# EasyEDA Pro project macro.epro

# Schematic WirelessMacropad
Board Name: WirelessMacropad; Create Date: 2025-08-01; Page Name: WirelessMacropad; Project Name: MacroController; Schematic Name: WirelessMacropad; Update Date: 2025-07-31; File: WirelessMacropad; Id: /; Sheet: /
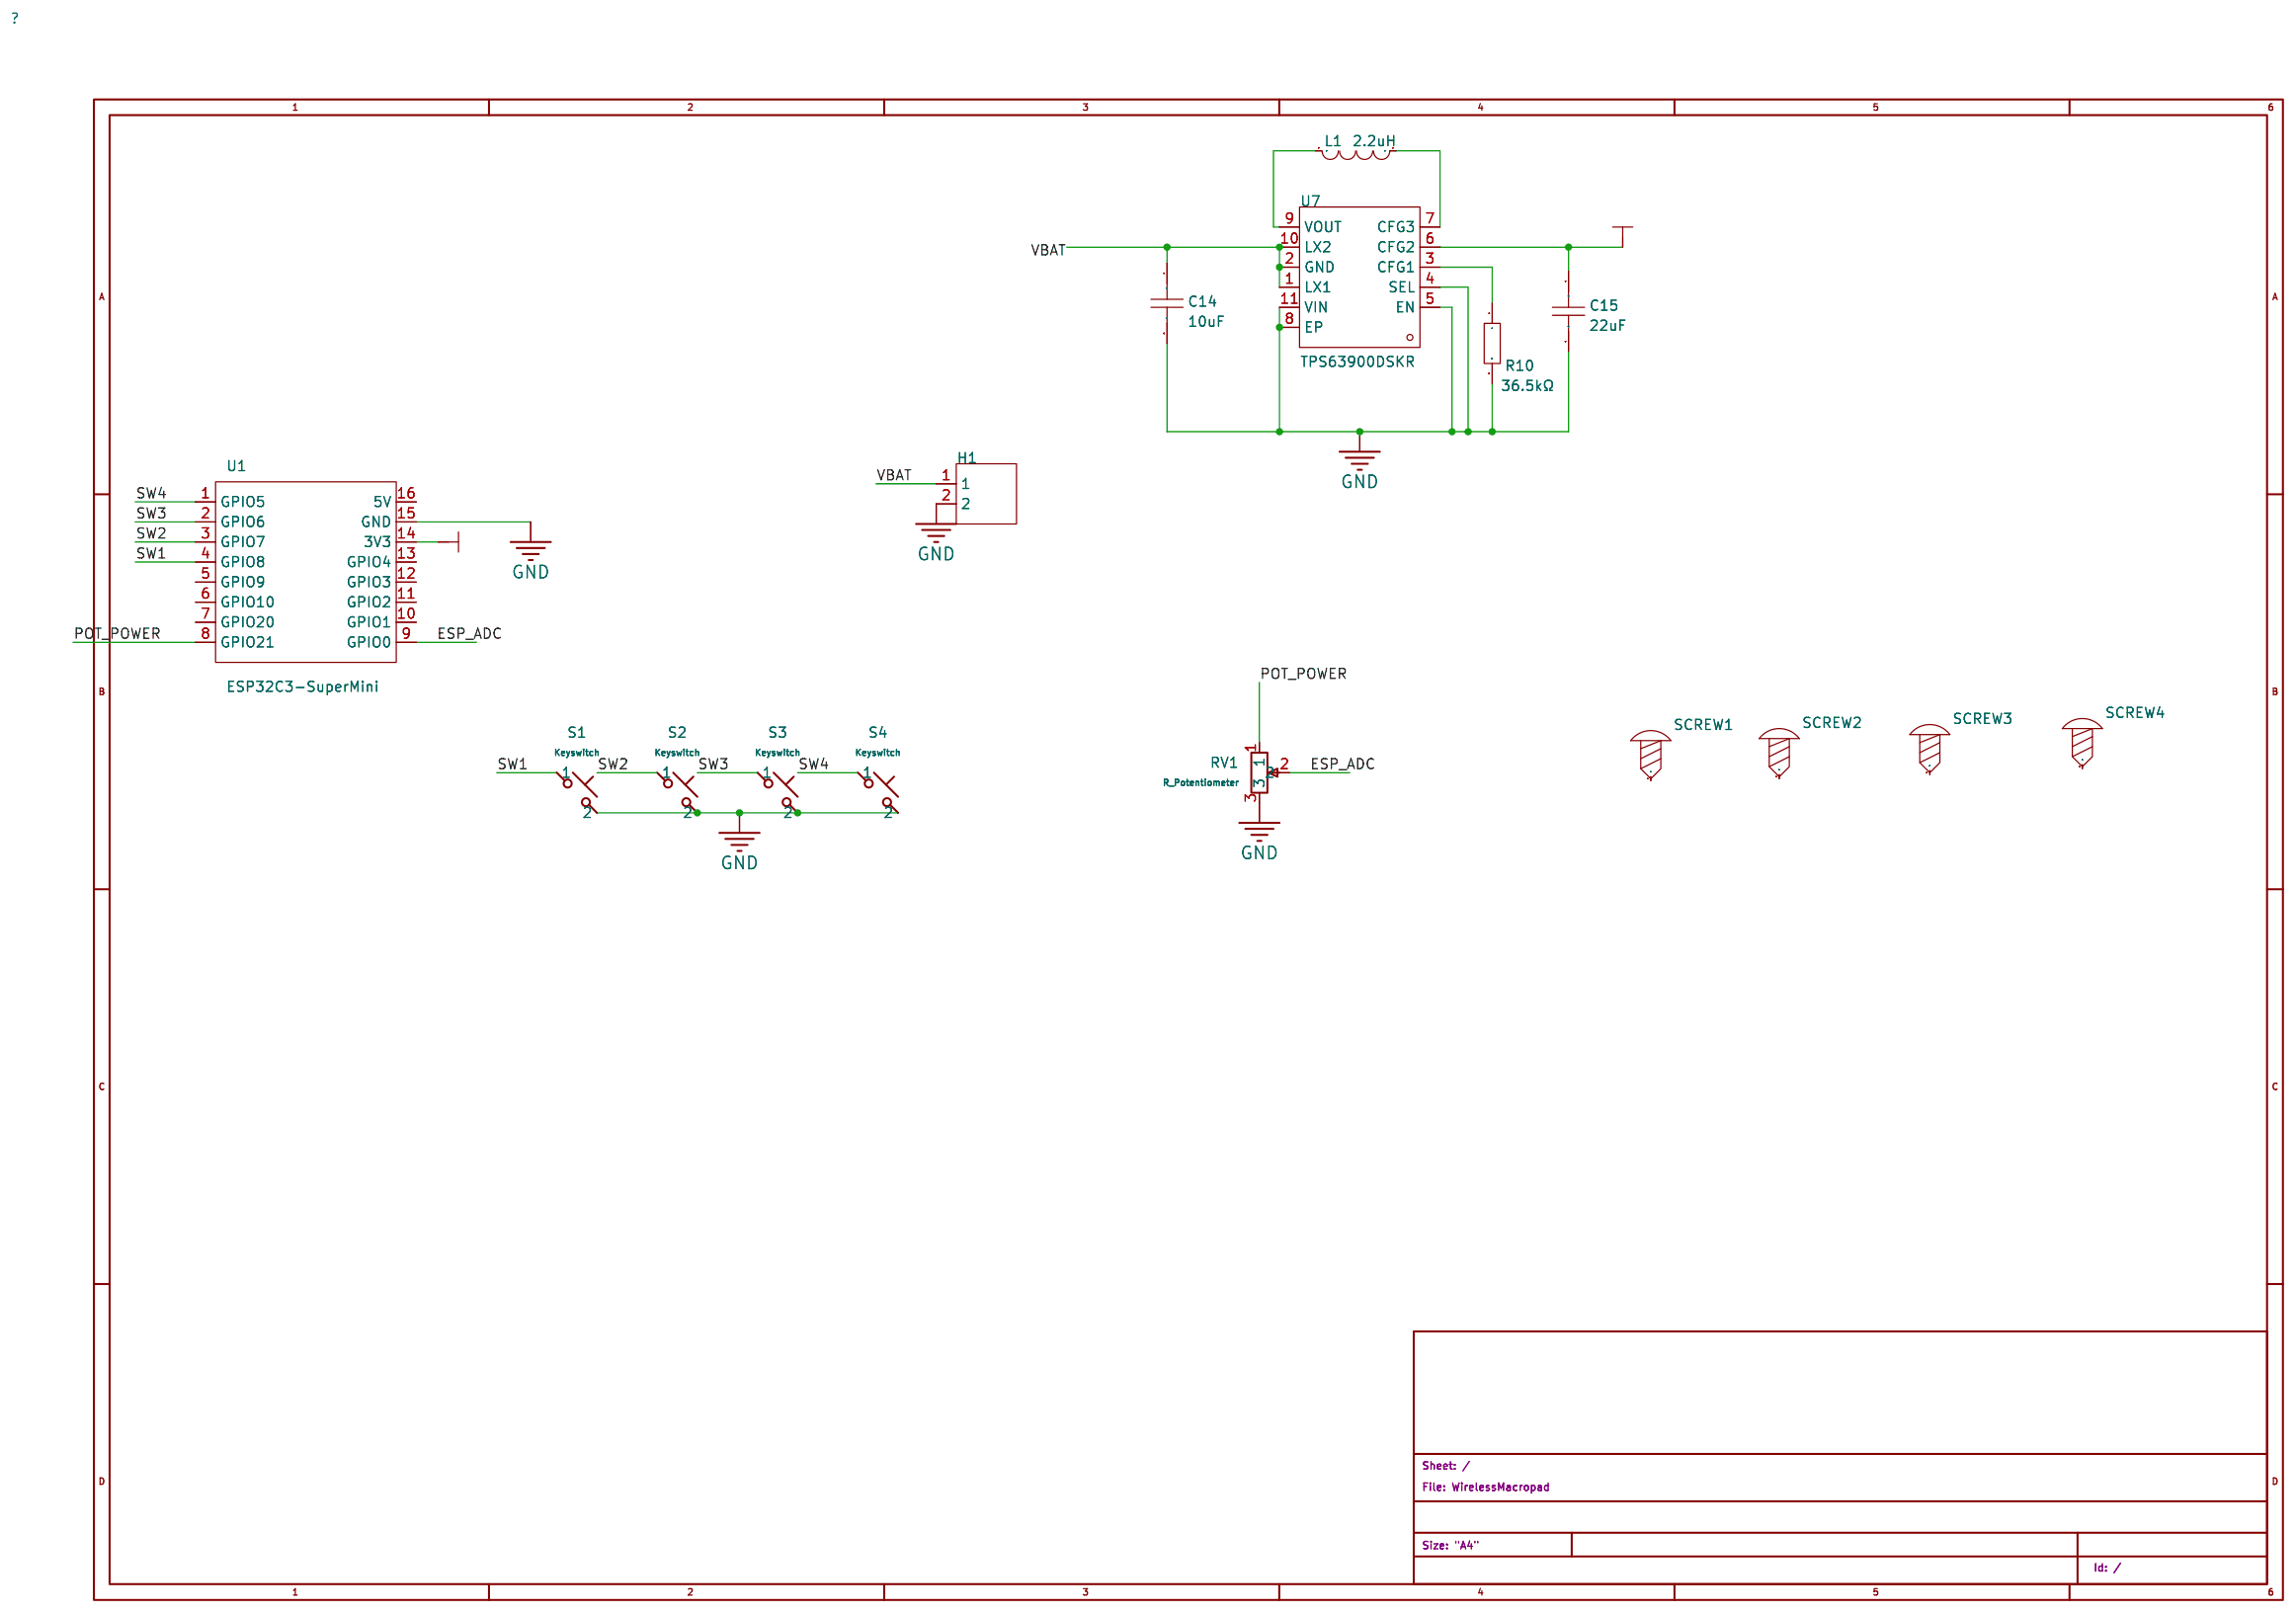
[diagram p0: schematic sheet]

## Parts
C14  10uF  [C0402]
C15  22uF  [C0805]
H1  -  [HDR-TH_2P-P2.54-V-M-1]
L1  2.2uH  [IND-SMD_L4.5-W4.0_SLF0403-1]
R10  36.5kΩ  [R0402]
RV1  R_Potentiometer  [ScottoKeebs_Miscellaneous:Sliding_Pot]
S1  Keyswitch  [ScottoKeebs_Hotswap:Hotswap_MX_1.00u]
S2  Keyswitch  [ScottoKeebs_Hotswap:Hotswap_MX_1.00u]
S3  Keyswitch  [ScottoKeebs_Hotswap:Hotswap_MX_1.00u]
S4  Keyswitch  [ScottoKeebs_Hotswap:Hotswap_MX_1.00u]
SCREW1  -  [Screw-Hole-M2]
SCREW2  -  [Screw-Hole-M2]
SCREW3  -  [Screw-Hole-M2]
SCREW4  -  [Screw-Hole-M2]
U1  ESP32C3-SuperMini  [COMM-SMD_16P-L22.5-W18.0-P2.54-TL]
U7  TPS63900DSKR  [WSON-10_L2.5-W2.5-W0.50-TL-EP]

## Library data of the parts
C14 = CL05A106MQ5NUNC: Capacitance: Tolerance:±20% Tolerance:±20% Voltage Rated: Temperature Coefficient:; LCSC Part Name: 10uF ±20% 6.3V; Supplier Part: C15525; Manufacturer: SAMSUNG(三星); Supplier Footprint: 0402; JLCPCB Part Class: Basic Part; Datasheet: https://atta.szlcsc.com/upload/public/pdf/source/20220823/2B02EE04F8F211D38A52DCB16EB6BEBA.pdf; Supplier: LCSC; Tolerance: ±20%
C15 = CL21A226MAQNNNE: Capacitance: Tolerance:±20% Tolerance:±20% Voltage Rated: Temperature Coefficient:; LCSC Part Name: 22uF ±20% 25V; Supplier Part: C45783; Manufacturer: SAMSUNG(三星); Supplier Footprint: 0805; JLCPCB Part Class: Basic Part; Datasheet: https://atta.szlcsc.com/upload/public/pdf/source/20160218/1457707763339.pdf; Supplier: LCSC; Tolerance: ±20%
H1 = HDR-M_2.54_1x2P: Supplier Footprint: Through
L1 = CY43-2.2UH: Inductance: Tolerance:±20% Tolerance:±20% Rated Current: Saturation Current (Isat):- DC Resistance (DCR): Q @ Freq:- Frequency - Self Resonant:- Ratings:; LCSC Part Name: 2.2uH ±20%; Supplier Part: C2929416; Manufacturer: SHOU HAN(首韩); Supplier Footprint: SMD,4.5x4mm; JLCPCB Part Class: Extended Part; Datasheet: https://atta.szlcsc.com/upload/public/pdf/source/20211213/02D0D236E4480B75E64C77ABE9E913B4.pdf; Supplier: LCSC; Tolerance: ±20%
R10 = AC0402FR-0736K5L: Type:Thick Film Resistors Resistance:36.5kΩ Tolerance:±1% Tolerance:±1% Power(Watts):62.5mW Voltage-Supply(Max):50V Temperature Coefficient:±100ppm/℃ Temperature Coefficient:±100ppm/℃ Operating Temperature:-55℃~+155℃ Operating Temperature:-55℃~+155℃; LCSC Part Name: 厚膜电阻 36.5kΩ ±1% 62.5mW; Supplier Part: C144766; Manufacturer: YAGEO(国巨); Supplier Footprint: 0402; JLCPCB Part Class: Extended Part; Datasheet: https://atta.szlcsc.com/upload/public/pdf/source/20180927/C229861_4ABDC471507C1ED6AFB4BA66AFC8620A.pdf; Supplier: LCSC; Type: Thick Film Resistors; Tolerance: ±1%; Power(Watts): 62.5mW; Voltage-Supply(Max): 50V; Temperature Coefficient: ±100ppm/℃; Operating Temperature: -55℃~+155℃
RV1 = Device_R_Potentiometer: Potentiometer; Users: REF**
S1-S4 = ScottoKeebs_Placeholder_Keyswitch: Push button switch, normally open, two pins, 45° tilted; Users: REF**
SCREW1-SCREW4 = Screw-Hole-M2: Supplier Footprint: 插件
U1 = ESP32C3-SuperMini: Supplier Part: C9900147397; Supplier Footprint: SMD-16P; JLCPCB Part Class: Extended Part; Supplier: LCSC
U7 = TPS63900DSKR: Input Voltage:1.8V~5.5V Input Voltage:1.8V~5.5V Output Current:400mA Switching Frequency:- Switching Frequency:- Operating Temperature:-40℃~+125℃@(TJ) Operating Temperature:-40℃~+125℃@(TJ) Synchronous Rectification:Yes Number of Outputs:- Topology:Step-do; LCSC Part Name: 1.8V至5.5V,75nA超低静态电流同步升降压转换器; Supplier Part: C1518762; Manufacturer: TI(德州仪器); Supplier Footprint: WSON-10-EP(2.5x2.5); Datasheet: https://www.ti.com/cn/lit/gpn/tps63900; Supplier: LCSC; Input Voltage: 1.8V~5.5V; Output Current: 400mA; Operating Temperature: -40℃~+125℃@(TJ); Synchronous Rectification: Yes; Topology: Step-down-Boost

## Nets
+3V3: C15.1 U1.14(3V3) U7.6(CFG2)
GND: C14.2 C15.2 H1.2 R10.2 RV1.3 S1.2 S2.2 S3.2 S4.2 U1.15(GND) U7.4(SEL) U7.5(EN) U7.8(EP) U7.11(VIN)
VBAT: C14.1 H1.1 U7.1(LX1) U7.2(GND) U7.10(LX2)
ESP_ADC: RV1.2 U1.9(GPIO0)
POT_POWER: RV1.1 U1.8(GPIO21)
SW1: S1.1 U1.4(GPIO8)
SW2: S2.1 U1.3(GPIO7)
SW3: S3.1 U1.2(GPIO6)
SW4: S4.1 U1.1(GPIO5)
$1N695: R10.1 U7.3(CFG1)
$1N698: L1.2 U7.9(VOUT)
$1N699: L1.1 U7.7(CFG3)

Not connected (* = marked no-connect by the designer): SCREW1 1; SCREW2 1; SCREW3 1; SCREW4 1; U1 5(GPIO9) 6(GPIO10) 7(GPIO20) 10(GPIO1) 11(GPIO2) 12(GPIO3) 13(GPIO4) 16(5V)

# Board WirelessMacropad
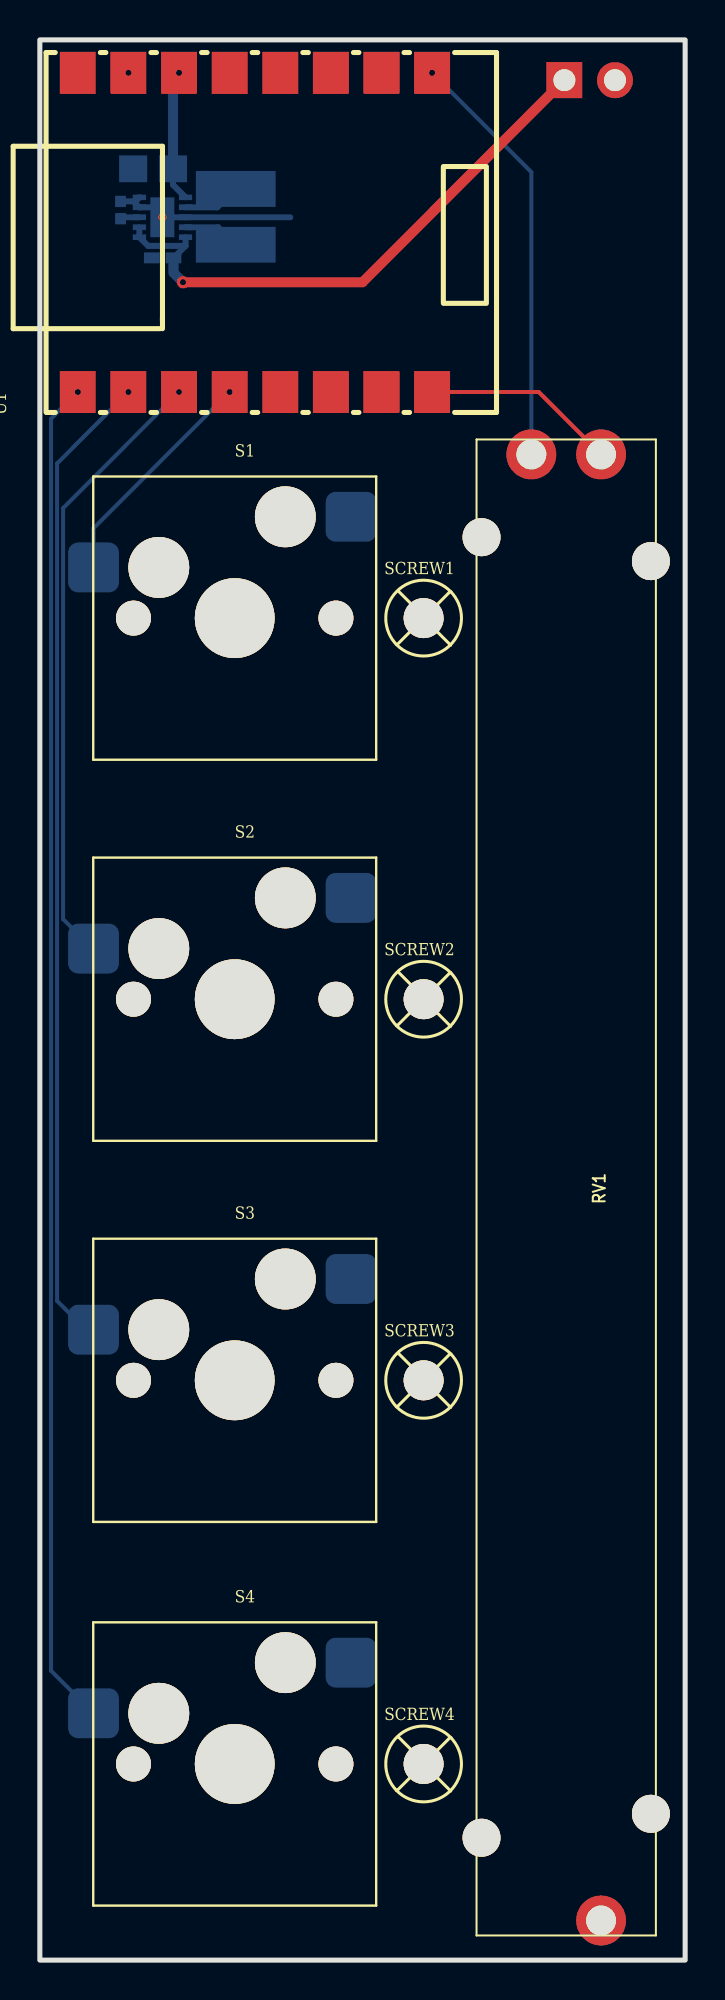
[diagram p1: board, top side]
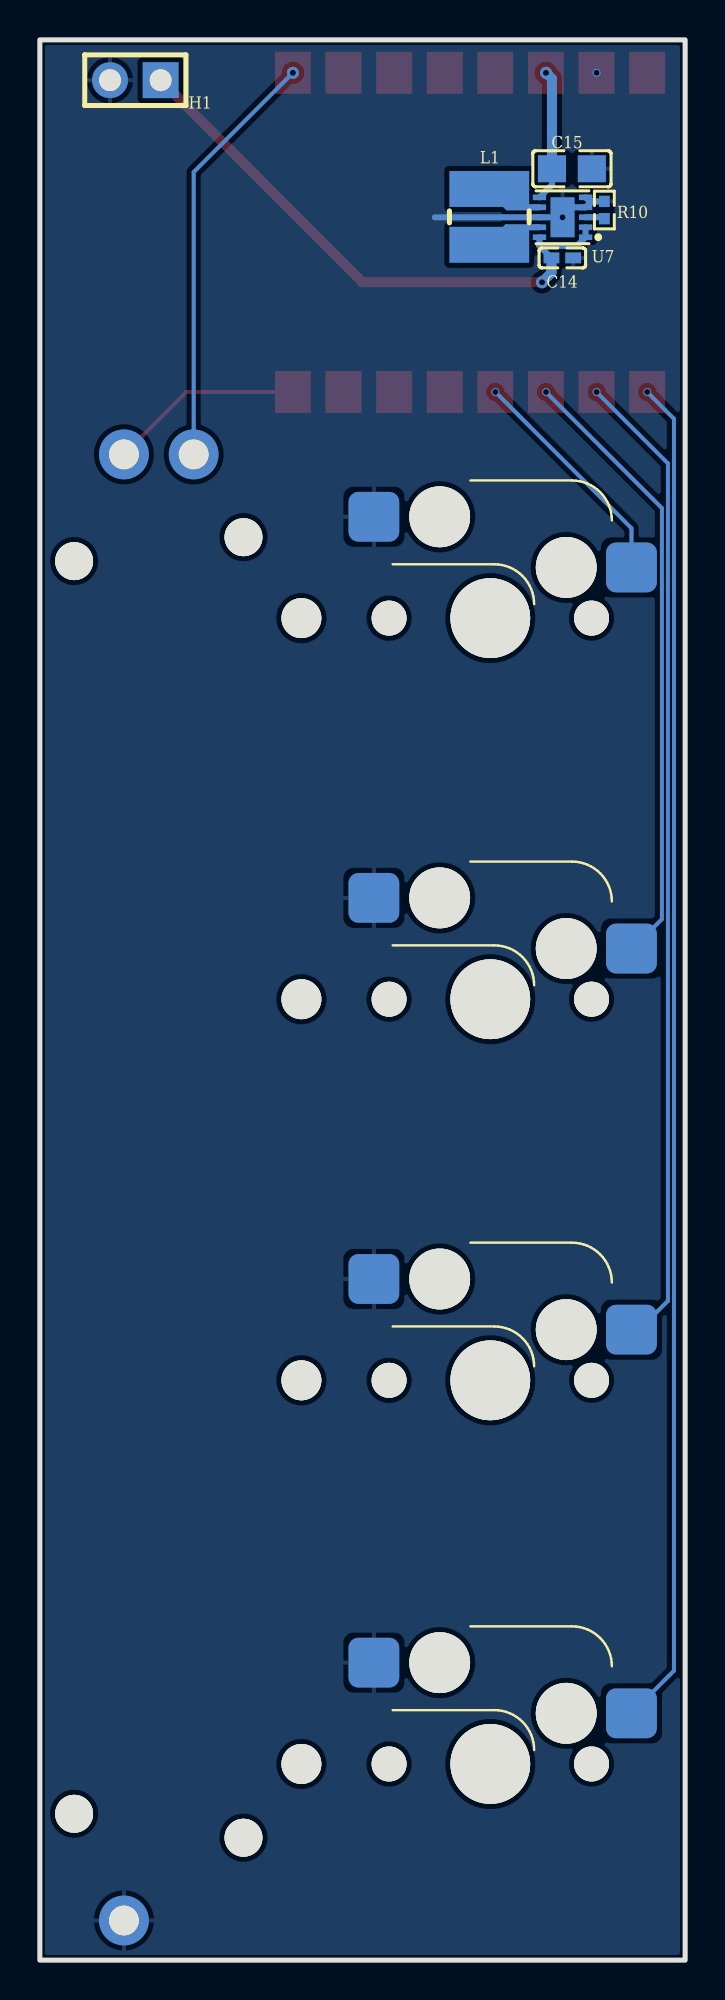
[diagram p2: board, bottom side, seen from below]

Outline 32.38 x 96.27 mm; copper layers: Top Layer, Bottom Layer. Coordinates in mm from the lower left corner of the outline.
Outline path: rectangle 0,96.27 32.38,0
Stack: Top Layer 0.035mm / Dielectric1 1.51mm FR4 er 4.5 / Bottom Layer 0.035mm

## Design rules (mm)
template: User Custom Config
spacing safeClearance (default): track to track 0.102, other pairs 0.152 to 0.3
track width trackWidth (default): min 0.127, default 0.254, max 2.54
differential pair differentialPair (default): width min 0.127, default 0.254, max 2.54; gap min 0.152, default 0.152
via viaSize (default): diameter min 0.4, default 0.4, max 10; hole min 0.3, default 0.3, max 6

## Placement (name value [footprint] x y rotation side)
C14  10uF  [C0402]  6.16 85.34 180 bottom
C15  22uF  [C0805]  5.68 89.81 180 bottom
H1  -  [HDR-TH_2P-P2.54-V-M-1]  27.59 94.25 0 bottom
L1  2.2uH  [IND-SMD_L4.5-W4.0_SLF0403-1]  9.83 87.39 270 bottom
R10  36.5kΩ  [R0402]  4.05 87.74 90 bottom
RV1  R_Potentiometer  [ScottoKeebs_Miscellaneous:Sliding_Pot]  26.42 38.74 0 top
S1  Keyswitch  [ScottoKeebs_Hotswap:Hotswap_MX_1.00u]  9.78 67.28 0 top
S2  Keyswitch  [ScottoKeebs_Hotswap:Hotswap_MX_1.00u]  9.78 48.17 0 top
S3  Keyswitch  [ScottoKeebs_Hotswap:Hotswap_MX_1.00u]  9.78 29.07 0 top
S4  Keyswitch  [ScottoKeebs_Hotswap:Hotswap_MX_1.00u]  9.78 9.83 0 top
SCREW1  -  [Screw-Hole-M2]  19.26 67.28 0 top
SCREW2  -  [Screw-Hole-M2]  19.26 48.17 0 top
SCREW3  -  [Screw-Hole-M2]  19.26 29.07 0 top
SCREW4  -  [Screw-Hole-M2]  19.26 9.83 0 top
U1  ESP32C3-SuperMini  [COMM-SMD_16P-L22.5-W18.0-P2.54-TL]  10.8 86.61 90 top
U7  TPS63900DSKR  [WSON-10_L2.5-W2.5-W0.50-TL-EP]  6.15 87.37 0 bottom

## Footprints (pads in the part's own frame, mm; a bottom-side part is the same pattern mirrored in y, then rotated)
C0402
  rect 0.79x0.54 smd: 1(-0.545,0) 2(0.545,0)
C0805
  rect 1.41x1.35 smd: 1(-1,0) 2(1,0)
COMM-SMD_16P-L22.5-W18.0-P2.54-TL
  rect 2.102x1.802 smd: 1(-8.001,8.89) 2(-8.001,6.35) 3(-8.001,3.81) 4(-8.001,1.27) 5(-8.001,-1.27) 6(-8.001,-3.81) 7(-8.001,-6.35) 8(-8.001,-8.89) 9(8.001,-8.89) 10(8.001,-6.35) 11(8.001,-3.81) 12(8.001,-1.27) 13(8.001,1.27) 14(8.001,3.81) 15(8.001,6.35) 16(8.001,8.89)
HDR-TH_2P-P2.54-V-M-1
  rect 1.8x1.8 hole 1.1: 1(-1.27,0)
  round 1.8 hole 1.1: 2(1.27,0)
IND-SMD_L4.5-W4.0_SLF0403-1
  rect 1.8x4 smd: 1(-1.4,0) 2(1.4,0)
R0402
  rect 0.566x0.54 smd: 1(-0.433,0) 2(0.433,0)
ScottoKeebs_Hotswap:Hotswap_MX_1.00u
  round 1.75 hole 1.75: (-5.08,0) (5.08,0)
  round 3.05 hole 3.05: (-3.81,2.54) (2.54,5.08)
  round 4 hole 4: (0,0)
  rrect 2.55x2.5 smd far side: 1(-7.085,2.54) 2(5.842,5.08)
ScottoKeebs_Miscellaneous:Sliding_Pot
  round 1.9 hole 1.9: (-4.25,32.6) (-4.25,-32.6) (4.25,31.4) (4.25,-31.4)
  round 2.5 hole 1.5: 1(1.75,36.75) 2(-1.75,36.75) 3(1.75,-36.75)
Screw-Hole-M2
  round 2 hole 2: 1(0,0)
WSON-10_L2.5-W2.5-W0.50-TL-EP
  rect 0.665x0.28 smd: 1(-1.157,1) 2(-1.157,0.5) 3(-1.157,0) 4(-1.157,-0.5) 5(-1.157,-1) 6(1.157,-1) 7(1.157,-0.5) 8(1.157,0) 9(1.157,0.5) 10(1.157,1)
  rect 1.2x2 smd: 11(0,0)

## Nets
As in the schematic.

Pads without a net: SCREW1 1; SCREW2 1; SCREW3 1; SCREW4 1; U1 5 6 7 10 11 12 13 16

## Via types
v1: diameter 0.4, hole 0.3, Top Layer to Bottom Layer, 6 vias
v2: diameter 0.61, hole 0.305, Top Layer to Bottom Layer, 3 vias

## Routing (per net, layer and track width the routed paths; a pad name or vN(x,y) marks a point on that pad's centre or on a via; arc(x,y) is an arc through that point)
+3V3: length 6.6
  Bottom Layer w0.299: U7.6 6.68,89 C15.1
  Bottom Layer w0.5: v2(6.99,94.62) 6.68,94.31 C15.1
GND: length 9.2
  Bottom Layer w0.299: 4.7,88.17 4.79,88.17 U7.5 ; 4.7,88.17 R10.2 ; 4.7,88.17 U7.4 5.65,87.87 v1(6.15,87.37) U7.8 12.57,87.37
  vias: v1(4.44,94.62)
VBAT: length 29
  Top Layer w0.5: H1.1 16.19,84.12 v2(7.18,84.12)
  Bottom Layer w0.299: U7.2 U7.1 5.43,85.94 7.31,85.94 ; U7.10 7.31,85.94 ; 7.31,85.94 C14.1
  Bottom Layer w0.5: v2(7.18,84.12) 6.71,84.59 C14.1
ESP_ADC: length 21.2
  Bottom Layer w0.201: v2(19.69,94.62) 24.67,89.63 RV1.2
POT_POWER: length 9.8
  Top Layer w0.201: 19.69,78.61 25.04,78.61 RV1.1
SW1: length 11.6
  Bottom Layer w0.201: S1.1 2.69,71.78 v1(9.53,78.61)
SW2: length 31
  Bottom Layer w0.201: v1(6.99,78.61) 1.17,72.79 1.17,52.19 2.64,50.71 S2.1
SW3: length 49.5
  Bottom Layer w0.201: S3.1 2.3,31.61 0.86,33.05 0.86,75.03 v1(4.44,78.61)
SW4: length 67.7
  Bottom Layer w0.201: v1(1.91,78.61) 0.56,77.27 0.56,14.51 2.69,12.37
$1N695: length 1
  Bottom Layer w0.299: R10.1 4.12,87.37 U7.3
$1N698: length 2.9
  Bottom Layer w0.299: U7.9 8.95,86.87 L1.2
$1N699: length 2.9
  Bottom Layer w0.299: U7.7 8.91,87.87 L1.1

## Copper pours and planes (outline as drawn; the poured copper is in the pictures)
GND on Bottom Layer: 0,96.27 32.38,96.27 32.38,0 0,0
